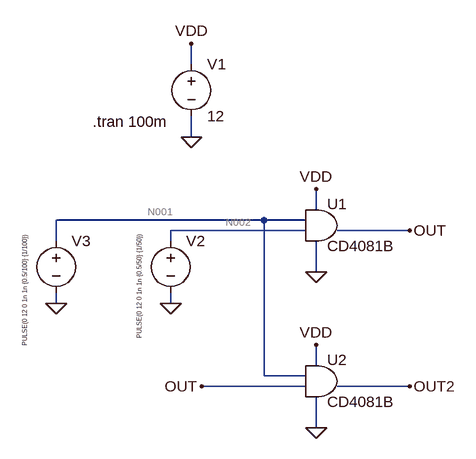
[diagram p0: schematic AND_CD4081B.asc]
AND_CD4081B.asc, the LTspice schematic file:
Version 4.1
SHEET 1 880 680
WIRE 48 -64 48 -96
WIRE 48 48 48 16
WIRE 240 160 240 128
WIRE 160 176 -160 176
WIRE 224 176 160 176
WIRE 224 192 16 192
WIRE 384 192 272 192
WIRE -160 208 -160 176
WIRE 16 208 16 192
WIRE 240 256 240 208
WIRE -160 304 -160 288
WIRE 16 304 16 288
WIRE 240 400 240 368
WIRE 160 416 160 176
WIRE 224 416 160 416
WIRE 224 432 64 432
WIRE 384 432 272 432
WIRE 240 496 240 448
FLAG 48 48 0
FLAG 48 -96 VDD
FLAG 240 128 VDD
FLAG 240 256 0
FLAG 384 192 OUT
FLAG 16 304 0
FLAG -160 304 0
FLAG 240 368 VDD
FLAG 240 496 0
FLAG 384 432 OUT2
FLAG 64 432 OUT
SYMBOL voltage 48 -80 R0
WINDOW 123 0 0 Left 0
WINDOW 39 0 0 Left 0
SYMATTR InstName V1
SYMATTR Value 12
SYMBOL voltage 16 192 R0
WINDOW 3 -48 4 VRight 0
WINDOW 123 0 0 Left 0
WINDOW 39 0 0 Left 0
SYMATTR Value PULSE(0 12 0 1n 1n {0.5/50} {1/50})
SYMATTR InstName V2
SYMBOL voltage -160 192 R0
WINDOW 3 -48 4 VRight 0
WINDOW 123 0 0 Left 0
WINDOW 39 0 0 Left 0
SYMATTR Value PULSE(0 12 0 1n 1n {0.5/100} {1/100})
SYMATTR InstName V3
SYMBOL MyLib\\Digital\\AND_CD4081B 256 128 R0
SYMATTR InstName U1
SYMBOL MyLib\\Digital\\AND_CD4081B 256 368 R0
SYMATTR InstName U2
TEXT -104 24 Left 2 !.tran 100m

The netlist it stands for:
* AND_CD4081B.asc
V1 VDD 0 12
V2 N002 0 PULSE(0 12 0 1n 1n {0.5/50} {1/50})
V3 N001 0 PULSE(0 12 0 1n 1n {0.5/100} {1/100})
X§U1 N001 N002 OUT VDD 0 CD4081B vdd={12} speed={1} tripdt={100n}  ; pins A B Y VDD GND
X§U2 N001 OUT OUT2 VDD 0 CD4081B vdd={12} speed={1} tripdt={100n}  ; pins A B Y VDD GND
.tran 100m
.lib MyLib/Digital/CD4000_v.lib
.backanno
.end

* Results of the author's LTspice run, read from the files saved beside the schematic
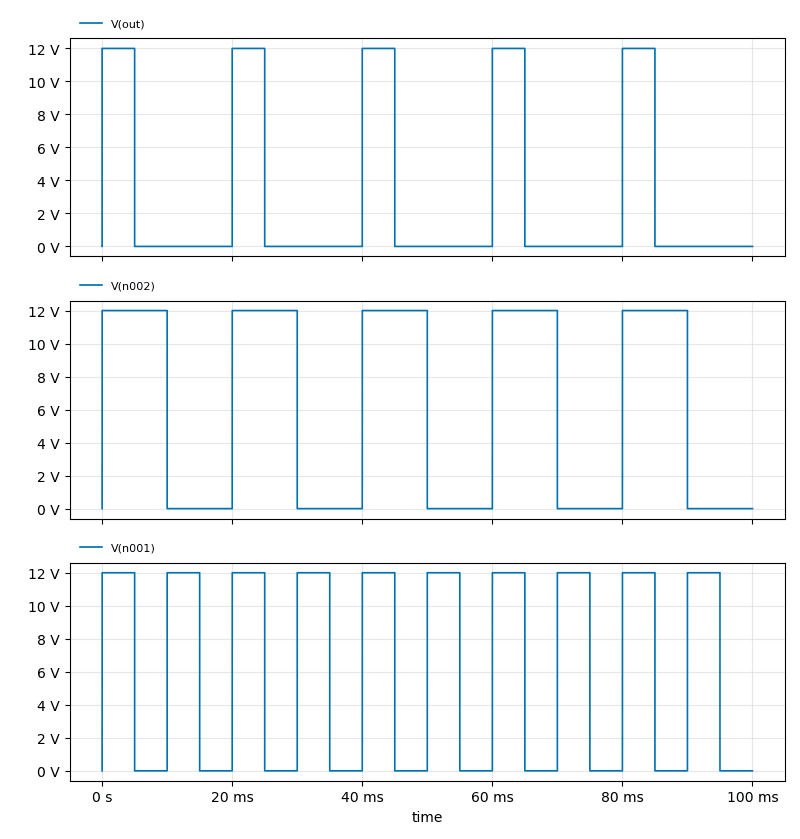
[diagram p1: Transient Analysis of AND_CD4081B.asc, plotted from the saved traces]
* Transient Analysis, 1 run:
*   V(out): min 0 V, max 12.01 V, average 3 V, rms 6 V, last 0 V
*   V(n002): min 0 V, max 12 V, average 6 V, rms 8.485 V, last 0 V
*   V(n001): min 0 V, max 12 V, average 6 V, rms 8.485 V, last 0 V